# Altium schematic sheet can.SchDoc: CAN/RS232/RS485
size A3; Author: Francesco Sacchi <batt@develer.com>; Organization: Develer s.r.l.; Address1: via Mugellese 1/A; Address2: 50019 Campi Bisenzio; Address3: Firenze; Address4: ITALY; DocumentNumber: 3; Revision: A; SheetNumber: 3; SheetTotal: 3; Hw_rev: R1
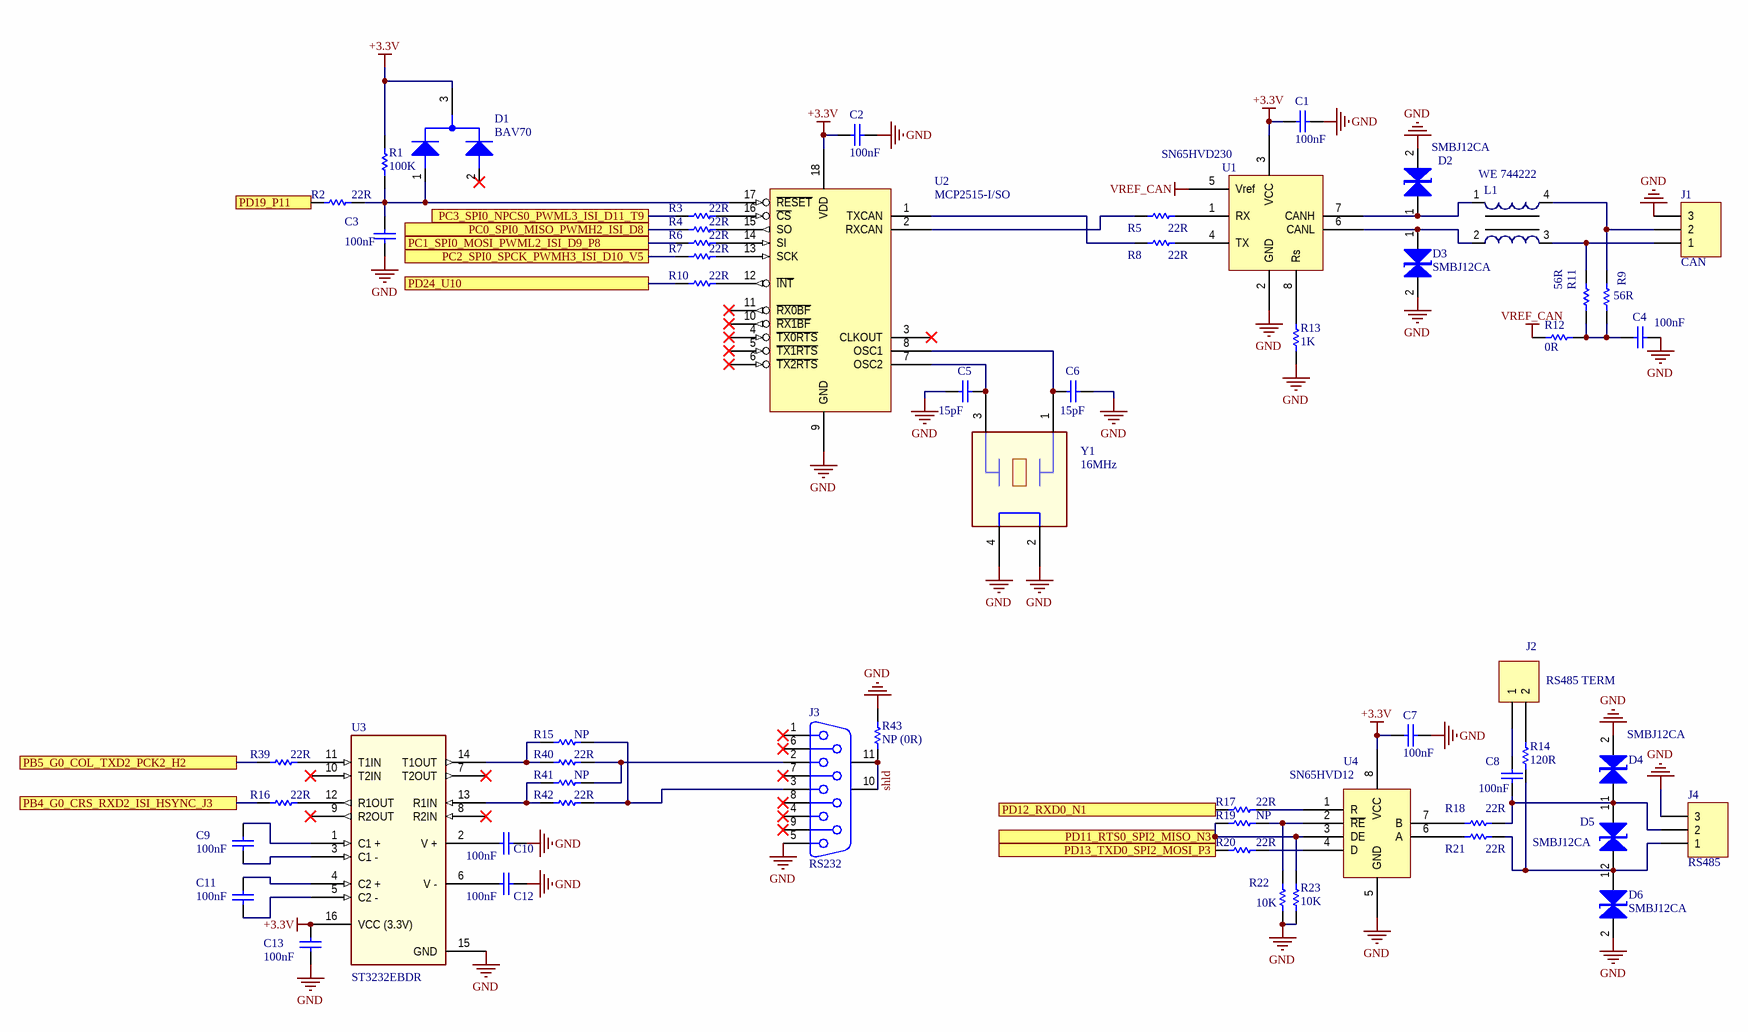
[diagram p0: can.SchDoc]

## Parts
C1  100nF  [0603_[1608]]
C2  100nF  [0603_[1608]]
C3  100nF  [0603_[1608]]
C4  100nF  [0603_[1608]]
C5  15pF  [0603_[1608]]
C6  15pF  [0603_[1608]]
C7  100nF  [0603_[1608]]
C8  100nF  [0603_[1608]]
C9  100nF  [0603_[1608]]
C10  100nF  [0603_[1608]]
C11  100nF  [0603_[1608]]
C12  100nF  [0603_[1608]]
C13  100nF  [0603_[1608]]
D1  BAV70  [SOT-23]
D2  SMBJ12CA  [DO214AA_12]
D3  SMBJ12CA  [DO214AA_12]
D4  SMBJ12CA  [DO214AA_12]
D5  SMBJ12CA  [DO214AA_12]
D6  SMBJ12CA  [DO214AA_12]
J1  CAN  [TBLOCK_1X3_3.5MM_HOR_THD]
J2  RS485 TERM  [HEADER_1X2_2.54MM_THD]
J3  RS232  [DSUB1.385-2H9_FEMALE]
J4  RS485  [TBLOCK_1X3_3.5MM_HOR_THD]
L1  WE 744222  [WE-SL2]
R1  100K  [0603_[1608]]
R2  22R  [0603_[1608]]
R3  22R  [0603_[1608]]
R4  22R  [0603_[1608]]
R5  22R  [0603_[1608]]
R6  22R  [0603_[1608]]
R7  22R  [0603_[1608]]
R8  22R  [0603_[1608]]
R9  56R  [0603_[1608]]
R10  22R  [0603_[1608]]
R11  56R  [0603_[1608]]
R12  0R  [0603_[1608]]
R13  1K  [0603_[1608]]
R14  120R  [0603_[1608]]
R15  NP  [0603_[1608]]
R16  22R  [0603_[1608]]
R17  22R  [0603_[1608]]
R18  22R  [0603_[1608]]
R19  NP  [0603_[1608]]
R20  22R  [0603_[1608]]
R21  22R  [0603_[1608]]
R22  10K  [0603_[1608]]
R23  10K  [0603_[1608]]
R39  22R  [0603_[1608]]
R40  22R  [0603_[1608]]
R41  NP  [0603_[1608]]
R42  22R  [0603_[1608]]
R43  NP (0R)  [0603_[1608]]
U1  SN65HVD230  [SOIC8]
U2  MCP2515-I/SO  [SOIC18]
U3  ST3232EBDR  [SOIC16]
U4  SN65HVD12  [SOIC8]
Y1  16MHz  [CRYSTAL_3.2X2.5MM_4P_SMD]

## Ports
PB4_G0_CRS_RXD2_ISI_HSYNC_J3, PB5_G0_COL_TXD2_PCK2_H2, PC0_SPI0_MISO_PWMH2_ISI_D8, PC1_SPI0_MOSI_PWML2_ISI_D9_P8, PC2_SPI0_SPCK_PWMH3_ISI_D10_V5, PC3_SPI0_NPCS0_PWML3_ISI_D11_T9, PD11_RTS0_SPI2_MISO_N3, PD12_RXD0_N1, PD13_TXD0_SPI2_MOSI_P3, PD19_P11, PD24_U10

## Nets
+3.3V: C1.2 C2.2 C7.2 C13.2 D1.3 R1.1 U1.3(VCC) U2.18(VDD) U3.16(VCC_(3.3V)) U4.8(VCC)
GND: C1.1 C2.1 C3.2 C4.1 C5.2 C6.1 C7.1 C10.1 C12.1 C13.1 D2.2 D3.2 D4.2 D6.2 J1.3 J3.5 J4.3 R13.1 R22.1 R23.1 R43.1 U1.2(GND) U2.9(GND) U3.15(GND) U4.5(GND) Y1.2 Y1.4
VREF_CAN: R12.1 U1.5(Vref)
PB4_G0_CRS_RXD2_ISI_HSYNC_J3: R16.1 ; port PB4_G0_CRS_RXD2_ISI_HSYNC_J3
PB5_G0_COL_TXD2_PCK2_H2: R39.1 ; port PB5_G0_COL_TXD2_PCK2_H2
PC0_SPI0_MISO_PWMH2_ISI_D8: R4.1 ; port PC0_SPI0_MISO_PWMH2_ISI_D8
PC1_SPI0_MOSI_PWML2_ISI_D9_P8: R6.1 ; port PC1_SPI0_MOSI_PWML2_ISI_D9_P8
PC2_SPI0_SPCK_PWMH3_ISI_D10_V5: R7.1 ; port PC2_SPI0_SPCK_PWMH3_ISI_D10_V5
PC3_SPI0_NPCS0_PWML3_ISI_D11_T9: R3.1 ; port PC3_SPI0_NPCS0_PWML3_ISI_D11_T9
PD11_RTS0_SPI2_MISO_N3: R19.2 R23.2 U4.3(DE) ; port PD11_RTS0_SPI2_MISO_N3
PD12_RXD0_N1: R17.2 ; port PD12_RXD0_N1
PD13_TXD0_SPI2_MOSI_P3: R20.2 ; port PD13_TXD0_SPI2_MOSI_P3
PD19_P11: R2.2 ; port PD19_P11
PD24_U10: R10.1 ; port PD24_U10
shld: J3.10(MH1) J3.11(MH2) R43.2
NetC3_1: C3.1 D1.1 R1.2 R2.1 U2.17(~{RESET})
NetC4_2: C4.2 R9.2 R11.2 R12.2
NetC5_1: C5.1 U2.7(OSC2) Y1.3
NetC6_2: C6.2 U2.8(OSC1) Y1.1
NetC8_1: C8.1 J2.1
NetC8_2: C8.2 D4.1 D5.1 J4.2 R18.2
NetC9_1: C9.1 U3.1(C1_+)
NetC9_2: C9.2 U3.3(C1_-)
NetC10_2: C10.2 U3.2(V_+)
NetC11_1: C11.1 U3.5(C2_-)
NetC11_2: C11.2 U3.4(C2_+)
NetC12_2: C12.2 U3.6(V_-)
NetD2_1: D2.1 L1.1 U1.7(CANH)
NetD3_1: D3.1 L1.2 U1.6(CANL)
NetD5_2: D5.2 D6.1 J4.1 R14.2 R21.2
NetJ1_1: J1.1 L1.3 R11.1
NetJ1_2: J1.2 L1.4 R9.1
NetJ2_2: J2.2 R14.1
NetJ3_2: J3.2 R40.2 R41.2
NetJ3_3: J3.3 R15.2 R42.2
NetR3_2: R3.2 U2.16(~{CS})
NetR4_2: R4.2 U2.15(SO)
NetR5_1: R5.1 U2.2(RXCAN)
NetR5_2: R5.2 U1.1(RX)
NetR6_2: R6.2 U2.14(SI)
NetR7_2: R7.2 U2.13(SCK)
NetR8_1: R8.1 U2.1(TXCAN)
NetR8_2: R8.2 U1.4(TX)
NetR10_2: R10.2 U2.12(~{INT})
NetR13_2: R13.2 U1.8(Rs)
NetR15_1: R15.1 R40.1 U3.14(T1OUT)
NetR16_2: R16.2 U3.12(R1OUT)
NetR17_1: R17.1 U4.1(R)
NetR18_1: R18.1 U4.7(B)
NetR19_1: R19.1 R22.2 U4.2(~{RE})
NetR20_1: R20.1 U4.4(D)
NetR21_1: R21.1 U4.6(A)
NetR39_2: R39.2 U3.11(T1IN)
NetR41_1: R41.1 R42.1 U3.13(R1IN)

Not connected (* = marked no-connect by the designer): D1 2*; J3 1* 4* 6* 7* 8* 9*; U2 3(CLKOUT)* 4(~{TX0RTS})* 5(~{TX1RTS})* 6(~{TX2RTS})* 10(~{RX1BF})* 11(~{RX0BF})*; U3 7(T2OUT)* 8(R2IN)* 9(R2OUT)* 10(T2IN)*

## Notes on the sheet
- Title:
- Status:
- Author:
- License:
- Project:
- -
- Prj Rev:
- Size:
- A3
- File:
- Date:
- Time:
- Sheet
- of

## Library data of the parts
C1-C4 C7-C13 = Cap: Ceramic X7R 50V; Value: 100pF; Published: 8-Jun-2000; LatestRevisionDate: 17-Jul-2002; LatestRevisionNote: Re-released for DXP Platform.; PackageReference: RAD-0.3; Publisher: Altium Limited; PackageDescription: Radial Cap, Thru-Hole; 2 Leads; 0.3 in Pin Spacing
C5 C6 = Cap: Ceramic 50V NP0/C0G; Value: 100pF; Published: 8-Jun-2000; LatestRevisionDate: 17-Jul-2002; LatestRevisionNote: Re-released for DXP Platform.; PackageReference: RAD-0.3; Publisher: Altium Limited; PackageDescription: Radial Cap, Thru-Hole; 2 Leads; 0.3 in Pin Spacing
D1 = BAV70: Diode
D2-D6 = TVS bi: TVS bidirectional
J1 J4 = Header 3: Terminal block Header 3.5mm Horizontal (WE 691322110003); LatestRevisionDate: 17-Jul-2002; LatestRevisionNote: Re-released for DXP Platform.; Publisher: Altium Limited
J2 = Header 2: Pin Header, 2.54mm, 1x2, 2pin; LatestRevisionDate: 17-Jul-2002; LatestRevisionNote: Re-released for DXP Platform.; Publisher: Altium Limited
J3 = D Connector 9: Receptacle Assembly, 9 Position, Right Angle (WE 618009231421); PackageDocument: O; Positions: 9; Published: 15-Jun-2001; LatestRevisionDate: 17-Jul-2002; LatestRevisionNote: Re-released for DXP Platform.; DatasheetDocument: 1-Sep-1999; PackageReference: 788750; Publisher: Altium Limited; Orientation: Right Angle; Gender: Receptacle
L1 = WE-CMB XS, 744821240: Common Mode line Filter; Manufacturer: Würth Elektronik eiSos GmbH; Inductance: 4.00 mH; partNo: 744821240; ComponentLink1Description: Manufacturer; ComponentLink1URL: http://www.we-online.de; Created by: Christin Zierenner; Created Date: March 2010; ComponentLink2Description: Datasheet; ComponentLink2URL: http://www.we-online.de/katalog/media/pdf/744821240.pdf
R1 R3-R16 R18 R19 R21-R23 R39-R42 = Res1: Resistor; Revision: July-2002: Re-released for DXP Platform.
R2 R17 R20 R43 = Res1: Resistor; Value: 1K; Published: 8-Jun-2000; Revision: July-2002: Re-released for DXP Platform.; Publisher: Altium Limited
U1 = SN65HVD230: 3.3V CAN bus transceiver (SN65HVD231; SN65HVD232)
U2 = MCP2515: Stand-Alone CAN controller with SPI interface
U3 = ST3232CDR: 3 to 5.5 V, low power, up to 400 kbps RS-232 driver; Part Number: STm ST3232CDR; Purchase Code: Digikey 497-3731-6-ND
U4 = SN65HVD12: 3.3V to RS485 interface
Y1 = CRYSTAL-4p: Crystal